# EAGLE design interface-2-cart (EAGLE 9.4.2)
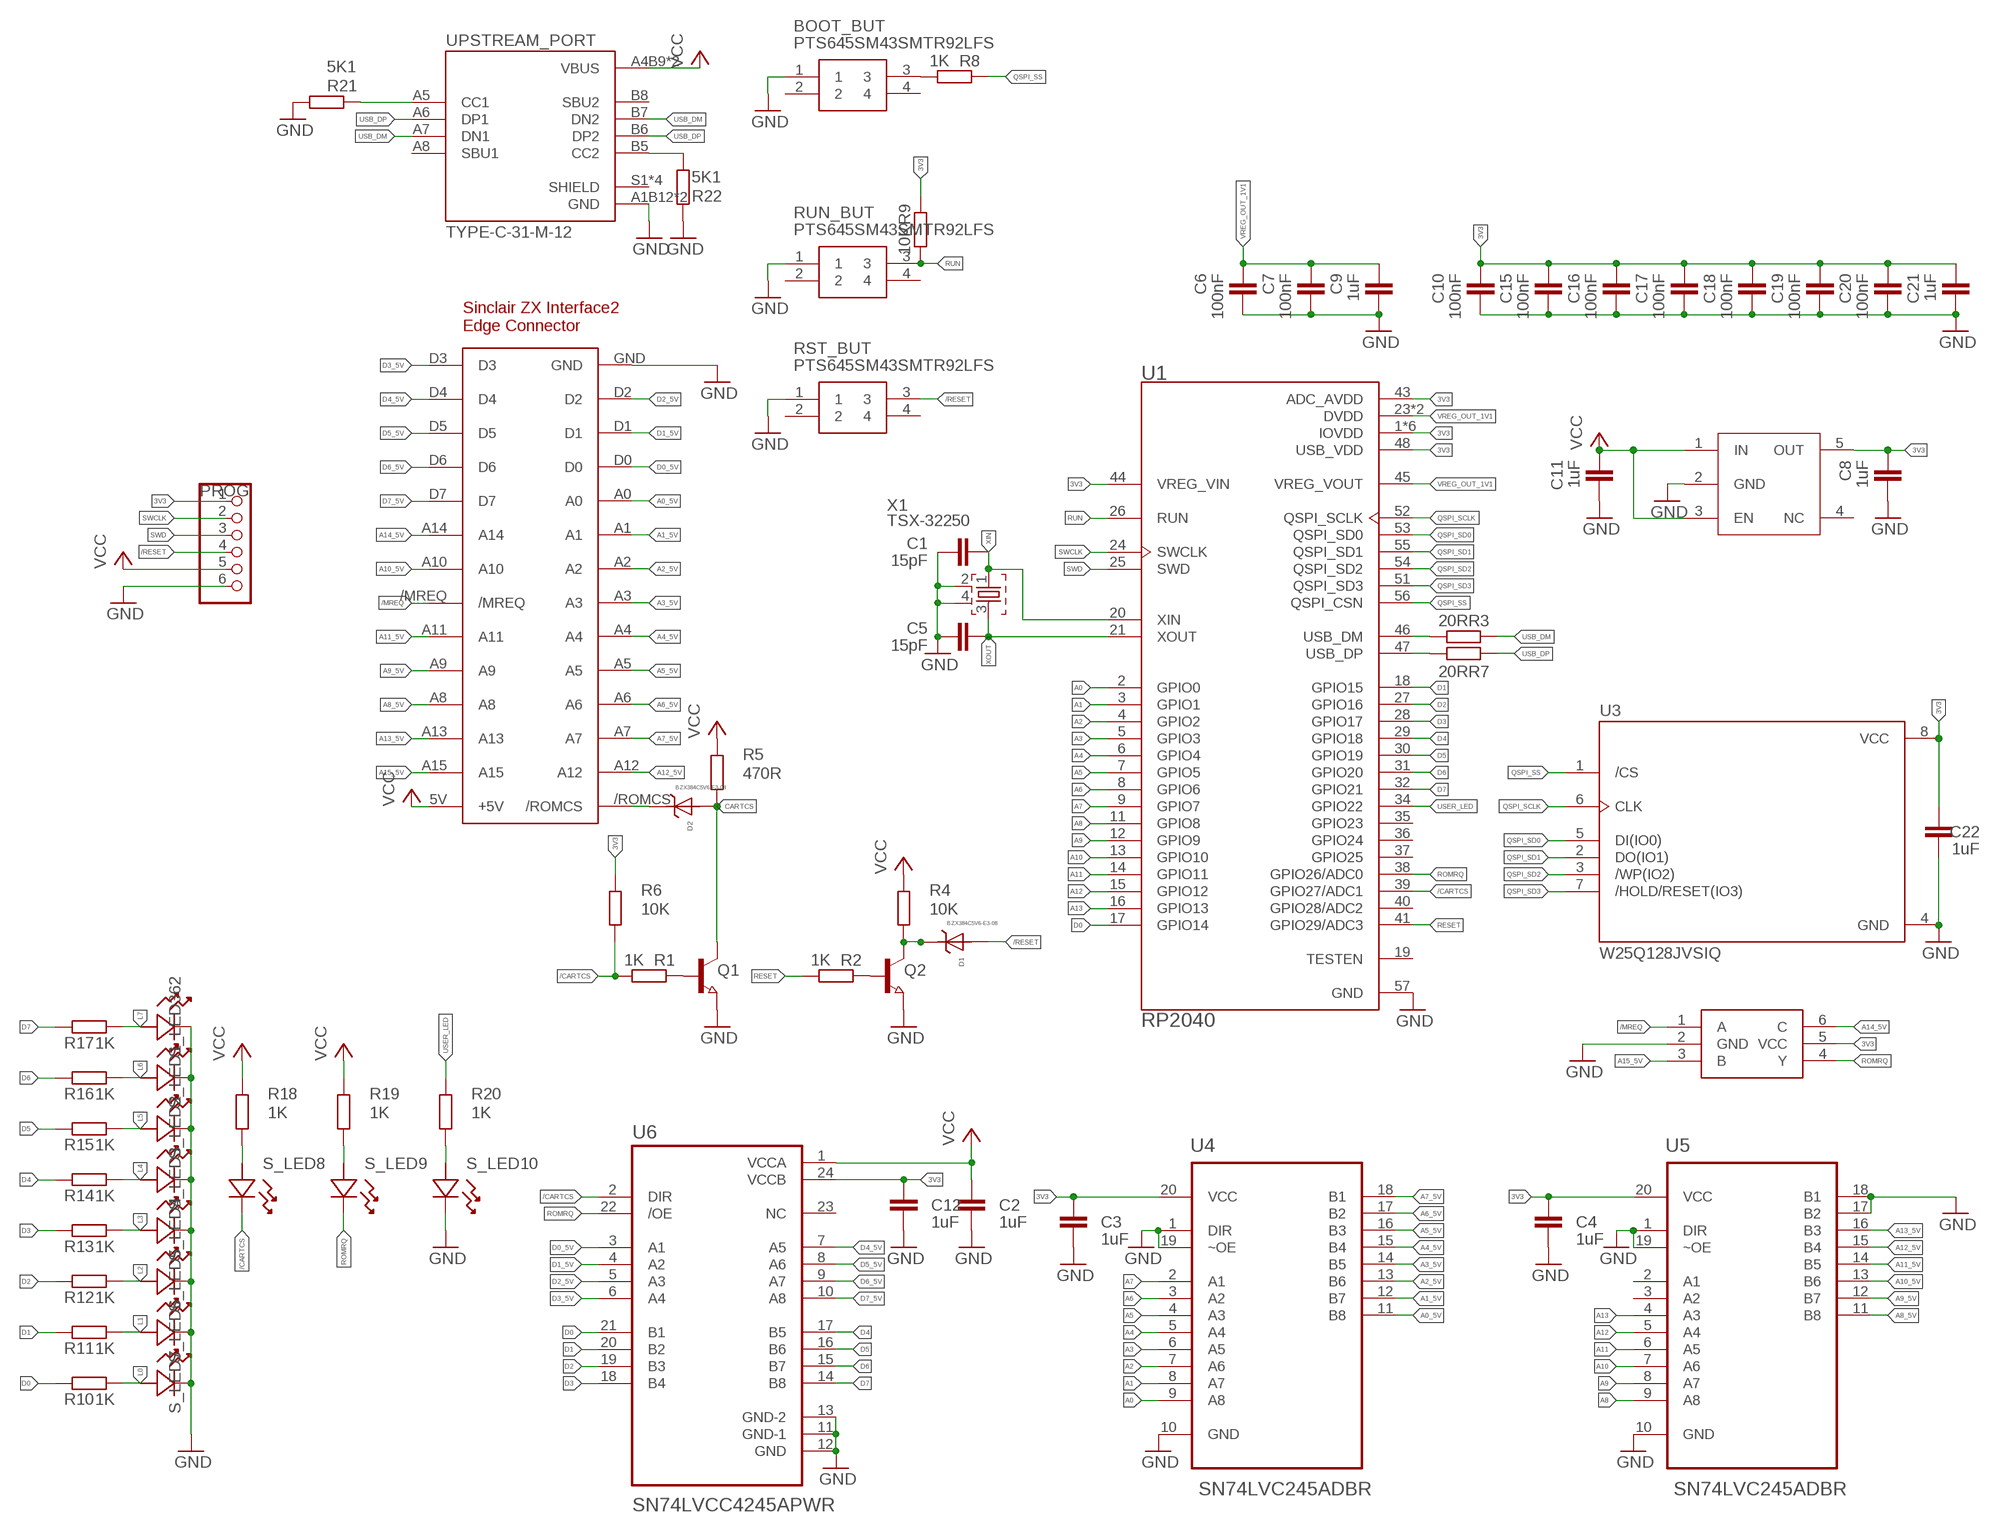
[diagram p0: schematic, sheet 1]

## Parts
3V3_REG2  3V3  NCP718BSN330T1G  [NCP718BSN330T1G]
BOOT_BUT  PTS645SM43SMTR92LFS  [PTS645(SMT)]
C1  15pF  C-EUC0402  [C0402]
C2  1uF  C-EUC0402  [C0402]
C3  1uF  C-EUC0402  [C0402]
C4  1uF  C-EUC0402  [C0402]
C5  15pF  C-EUC0402  [C0402]
C6  100nF  C-EUC0402  [C0402]
C7  100nF  C-EUC0402  [C0402]
C8  1uF  C-EUC0402  [C0402]
C9  1uF  C-EUC0402  [C0402]
C10  100nF  C-EUC0402  [C0402]
C11  1uF  C-EUC0402  [C0402]
C12  1uF  C-EUC0402  [C0402]
C15  100nF  C-EUC0402  [C0402]
C16  100nF  C-EUC0402  [C0402]
C17  100nF  C-EUC0402  [C0402]
C18  100nF  C-EUC0402  [C0402]
C19  100nF  C-EUC0402  [C0402]
C20  100nF  C-EUC0402  [C0402]
C21  1uF  C-EUC0402  [C0402]
C22  1uF  C-EUC0402  [C0402]
D1  BZX384C5V6-E3-08  [SOD-323]
D2  BZX384C5V6-E3-08  [SOD-323]
PROG  PINHD-1X6  [1X06]
Q1  NPN-TRANSISTOR_SOT23  [SOT23]
Q2  NPN-TRANSISTOR_SOT23  [SOT23]
R1  1K  R-EU_R0402  [R0402]
R2  1K  R-EU_R0402  [R0402]
R3  20R  R-EU_R0402  [R0402]
R4  10K  R-EU_R0402  [R0402]
R5  470R  R-EU_R0402  [R0402]
R6  10K  R-EU_R0402  [R0402]
R7  20R  R-EU_R0402  [R0402]
R8  1K  R-EU_R0402  [R0402]
R9  10K  R-EU_R0402  [R0402]
R10  1K  R-EU_R0402  [R0402]
R11  1K  R-EU_R0402  [R0402]
R12  1K  R-EU_R0402  [R0402]
R13  1K  R-EU_R0402  [R0402]
R14  1K  R-EU_R0402  [R0402]
R15  1K  R-EU_R0402  [R0402]
R16  1K  R-EU_R0402  [R0402]
R17  1K  R-EU_R0402  [R0402]
R18  1K  R-EU_R0402  [R0402]
R19  1K  R-EU_R0402  [R0402]
R20  1K  R-EU_R0402  [R0402]
R21  5K1  R-EU_R0402  [R0402]
R22  5K1  R-EU_R0402  [R0402]
RST_BUT  PTS645SM43SMTR92LFS  [PTS645(SMT)]
RUN_BUT  PTS645SM43SMTR92LFS  [PTS645(SMT)]
S_LED1  20mA  VLMW1500-GS08  [LED_VLMW15_VIS]
S_LED2  20mA  VLMW1500-GS08  [LED_VLMW15_VIS]
S_LED3  20mA  VLMW1500-GS08  [LED_VLMW15_VIS]
S_LED4  20mA  VLMW1500-GS08  [LED_VLMW15_VIS]
S_LED5  20mA  VLMW1500-GS08  [LED_VLMW15_VIS]
S_LED6  20mA  VLMW1500-GS08  [LED_VLMW15_VIS]
S_LED7  20mA  VLMW1500-GS08  [LED_VLMW15_VIS]
S_LED8  20mA  VLMW1500-GS08  [LED_VLMW15_VIS]
S_LED9  20mA  VLMW1500-GS08  [LED_VLMW15_VIS]
S_LED10  20mA  VLMW1500-GS08  [LED_VLMW15_VIS]
S_LED362  20mA  VLMW1500-GS08  [LED_VLMW15_VIS]
U1  RP2040  [QFN40P700X700X90-57N]
U3  W25Q128JVSIQ  [SOIC127P790X216-8N]
U4  SN74LVC245ADBR  [SOP65P780X200-20N]
U5  SN74LVC245ADBR  [SOP65P780X200-20N]
U6  SN74LVCC4245APWR  [SOP65P640X120-24N]
U$1  ZX_I2_ROM_EDGE_CONNECTOR  [ZX_I2_ROM_EDGE_CONNECTOR_V2]
U$2  74LVC1G332GW,125  [SOP65P210X110-6N]
UPSTREAM_PORT  TYPE-C-31-M-12  [HRO_TYPE-C-31-M-12]
X1  TSX-32250  [TSX-3225]

## Nets
3V3: 3V3_REG2.5(OUT) C3.2 C4.2 C8.1 C10.1 C12.2 C15.1 C16.1 C17.1 C18.1 C19.1 C20.1 C21.1 C22.1 PROG.1 R6.1 R9.2 U1.1(IOVDD) U1.10(IOVDD) U1.22(IOVDD) U1.33(IOVDD) U1.42(IOVDD) U1.43(ADC_AVDD) U1.44(VREG_VIN) U1.48(USB_VDD) U1.49(IOVDD) U3.8(VCC) U4.20(VCC) U5.20(VCC) U6.24(VCCB) U$2.5(VCC)
/CARTCS: R1.1 R6.2 S_LED8.C U1.39(GPIO27/ADC1) U6.2(DIR)
/MREQ: U$1./MREQ U$2.1(A)
/RESET: D1.A PROG.4 RST_BUT.3
/RESET_PROTECTED: D1.C Q2.3(C) R4.2
A0: U1.2(GPIO0) U4.9(A8)
A0_5V: U4.11(B8) U$1.A0
A1: U1.3(GPIO1) U4.8(A7)
A1_5V: U4.12(B7) U$1.A1
A2: U1.4(GPIO2) U4.7(A6)
A2_5V: U4.13(B6) U$1.A2
A3: U1.5(GPIO3) U4.6(A5)
A3_5V: U4.14(B5) U$1.A3
A4: U1.6(GPIO4) U4.5(A4)
A4_5V: U4.15(B4) U$1.A4
A5: U1.7(GPIO5) U4.4(A3)
A5_5V: U4.16(B3) U$1.A5
A6: U1.8(GPIO6) U4.3(A2)
A6_5V: U4.17(B2) U$1.A6
A7: U1.9(GPIO7) U4.2(A1)
A7_5V: U4.18(B1) U$1.A7
A8: U1.11(GPIO8) U5.9(A8)
A8_5V: U5.11(B8) U$1.A8
A9: U1.12(GPIO9) U5.8(A7)
A9_5V: U5.12(B7) U$1.A9
A10: U1.13(GPIO10) U5.7(A6)
A10_5V: U5.13(B6) U$1.A10
A11: U1.14(GPIO11) U5.6(A5)
A11_5V: U5.14(B5) U$1.A11
A12: U1.15(GPIO12) U5.5(A4)
A12_5V: U5.15(B4) U$1.A12
A13: U1.16(GPIO13) U5.4(A3)
A13_5V: U5.16(B3) U$1.A13
A14_5V: U$1.A14 U$2.6(C)
A15_5V: U$1.A15 U$2.3(B)
CARTCS: D2.A Q1.3(C) R5.2
D0: R10.2 U1.17(GPIO14) U6.21(B1)
D0_5V: U6.3(A1) U$1.D0
D1: R11.2 U1.18(GPIO15) U6.20(B2)
D1_5V: U6.4(A2) U$1.D1
D2: R12.2 U1.27(GPIO16) U6.19(B3)
D2_5V: U6.5(A3) U$1.D2
D3: R13.2 U1.28(GPIO17) U6.18(B4)
D3_5V: U6.6(A4) U$1.D3
D4: R14.2 U1.29(GPIO18) U6.17(B5)
D4_5V: U6.7(A5) U$1.D4
D5: R15.2 U1.30(GPIO19) U6.16(B6)
D5_5V: U6.8(A6) U$1.D5
D6: R16.2 U1.31(GPIO20) U6.15(B7)
D6_5V: U6.9(A7) U$1.D6
D7: R17.2 U1.32(GPIO21) U6.14(B8)
D7_5V: U6.10(A8) U$1.D7
GND: 3V3_REG2.2(GND) BOOT_BUT.1 C1.2 C2.1 C3.1 C4.1 C5.2 C6.2 C7.2 C8.2 C9.2 C10.2 C11.2 C12.1 C15.2 C16.2 C17.2 C18.2 C19.2 C20.2 C21.2 C22.2 PROG.6 Q1.2(E) Q2.2(E) R21.1 R22.1 RST_BUT.1 RUN_BUT.1 S_LED1.C S_LED2.C S_LED3.C S_LED4.C S_LED5.C S_LED6.C S_LED7.C S_LED10.C S_LED362.C U1.57(GND) U3.4(GND) U4.1(DIR) U4.10(GND) U4.19(~OE) U5.1(DIR) U5.10(GND) U5.17(B2) U5.18(B1) U5.19(~OE) U6.11(GND-1) U6.12(GND) U6.13(GND-2) U$1.GND U$2.2(GND) UPSTREAM_PORT.A1B12(GND) UPSTREAM_PORT.B1A12(GND) X1.2 X1.4
L0: R10.1 S_LED7.A
L1: R11.1 S_LED6.A
L2: R12.1 S_LED5.A
L3: R13.1 S_LED4.A
L4: R14.1 S_LED3.A
L5: R15.1 S_LED2.A
L6: R16.1 S_LED1.A
L7: R17.1 S_LED362.A
N$1: Q1.1(B) R1.2
N$2: Q2.1(B) R2.2
N$3: R3.1 U1.46(USB_DM)
N$4: R18.1 S_LED8.A
N$5: R19.1 S_LED9.A
N$6: R20.1 S_LED10.A
N$7: D2.C U$1./ROMCS
N$8: R7.1 U1.47(USB_DP)
N$9: BOOT_BUT.3 R8.1
N$18: R21.2 UPSTREAM_PORT.A5(CC1)
N$19: R22.2 UPSTREAM_PORT.B5(CC2)
QSPI_SCLK: U1.52(QSPI_SCLK) U3.6(CLK)
QSPI_SD0: U1.53(QSPI_SD0) U3.5(DI(IO0))
QSPI_SD1: U1.55(QSPI_SD1) U3.2(DO(IO1))
QSPI_SD2: U1.54(QSPI_SD2) U3.3(/WP(IO2))
QSPI_SD3: U1.51(QSPI_SD3) U3.7(/HOLD/RESET(IO3))
QSPI_SS: R8.2 U1.56(QSPI_CSN) U3.1(/CS)
RESET: R2.1 U1.41(GPIO29/ADC3)
ROMRQ: S_LED9.C U1.38(GPIO26/ADC0) U6.22(/OE) U$2.4(Y)
RUN: R9.1 RUN_BUT.3 U1.26(RUN)
SWCLK: PROG.2 U1.24(SWCLK)
SWD: PROG.3 U1.25(SWD)
USB_DM: R3.2 UPSTREAM_PORT.A7(DN1) UPSTREAM_PORT.B7(DN2)
USB_DP: R7.2 UPSTREAM_PORT.A6(DP1) UPSTREAM_PORT.B6(DP2)
USER_LED: R20.2 U1.34(GPIO22)
VCC: 3V3_REG2.1(IN) 3V3_REG2.3(EN) C2.2 C11.1 PROG.5 R4.1 R5.1 R18.2 R19.2 U6.1(VCCA) U$1.5V(+5V) UPSTREAM_PORT.A4B9(VBUS) UPSTREAM_PORT.B4A9(VBUS)
VREG_OUT_1V1: C6.1 C7.1 C9.1 U1.23(DVDD) U1.45(VREG_VOUT) U1.50(DVDD)
XIN: C1.1 U1.20(XIN) X1.1
XOUT: C5.1 U1.21(XOUT) X1.3
Unconnected: 3V3_REG2.4(NC) BOOT_BUT.2 BOOT_BUT.4 RST_BUT.2 RST_BUT.4 RUN_BUT.2 RUN_BUT.4 U1.19(TESTEN) U1.35(GPIO23) U1.36(GPIO24) U1.37(GPIO25) U1.40(GPIO28/ADC2) U5.2(A1) U5.3(A2) U6.23(NC) UPSTREAM_PORT.A8(SBU1) UPSTREAM_PORT.B8(SBU2) UPSTREAM_PORT.S1(SHIELD) UPSTREAM_PORT.S2(SHIELD) UPSTREAM_PORT.S3(SHIELD) UPSTREAM_PORT.S4(SHIELD)

## Library data of the parts
3V3_REG2 = IC-packages_BIG-pack V1.0:NCP718BSN330T1G
BOOT_BUT RST_BUT RUN_BUT = PTS645SM43SMTR92LFS:PTS645SM43SMTR92LFS: C & K COMPONENTS - PTS645SM43SMTR92LFS - SWITCH, SPST, 0.05A, 12VDC, SMD, 4.3MM Source: Datasheet <http://www.farnell.com/datasheets/1914518.pdf>; DESCRIPTION: C & K COMPONENTS - PTS645SM43SMTR92LFS - SWITCH, SPST, 0.05A, 12VDC, SMD, 4.3MM; HEIGHT: mm; MANUFACTURER_NAME: C & K COMPONENTS; MANUFACTURER_PART_NUMBER: PTS645SM43SMTR92LFS; MOUSER_PART_NUMBER: 611-PTS645SM43SMTR92; MOUSER_PRICE-STOCK: https://www.mouser.com/Search/Refine.aspx?Keyword=611-PTS645SM43SMTR92
C1-C12 C15-C22 = rcl:C-EU: CAPACITOR, European symbol; SPICEPREFIX: C
D1 D2 = BZX384C5V6-E3-08:BZX384C5V6-E3-08: VISHAY - Zener Single Diode, 5.6 V, 200 mW, SOD-323, 5 %, 2 Pins, 150 °C - SOD-323 Check availability <https://pricing.snapeda.com/parts/BZX384C5V6-E3-08/Vishay%20Semiconductors/view-part?ref=eda>; AVAILABILITY: In Stock; DESCRIPTION: Zener Diode Single 5.6V 5% 40Ohm 200mW 2-Pin SOD-323 T/R; MF: Vishay Semiconductors; MP: BZX384C5V6-E3-08; PACKAGE: None; PRICE: None; PURCHASE-URL: https://pricing.snapeda.com/search/part/BZX384C5V6-E3-08/?ref=eda
PROG = adafruit:PINHD-1X6: PIN HEADER
Q1 Q2 = semicon-smd-ipc:NPN-TRANSISTOR_: NPN TRANSISTOR
R1-R22 = rcl:R-EU_: RESISTOR, European symbol; SPICEPREFIX: R
S_LED1-S_LED10 S_LED362 = led-0402:VLMW1500-GS08; COPYRIGHT: Copyright (C) 2022 Ultra Librarian. All rights reserved.; MANUFACTURER_PART_NUMBER: VLMW1500-GS08; MFR_NAME: Vishay
U1 = RP2040:RP2040: Check availability <https://pricing.snapeda.com/parts/RP2040/Raspberry%20Pi/view-part?ref=eda>; AVAILABILITY: In Stock; CHECK_PRICES: https://www.snapeda.com/parts/RP2040/Raspberry+Pi/view-part/?ref=eda; DESCRIPTION: RP2040 chip for Raspberry Pi Pico - ARM® Cortex®-M0+ MCU 32-Bit; MF: Raspberry Pi; MP: RP2040; PACKAGE: None; PRICE: None; SNAPEDA_LINK: https://www.snapeda.com/parts/RP2040/Raspberry+Pi/view-part/?ref=snap
U3 = W25Q128JVSIQ:W25Q128JVSIQ: Check availability <https://pricing.snapeda.com/parts/W25Q128JVSIQ/Winbond%20Electronics/view-part?ref=eda>; AVAILABILITY: In Stock; CHECK_PRICES: https://www.snapeda.com/parts/W25Q128JVSIQ/Winbond+Electronics/view-part/?ref=eda; DESCRIPTION: FLASH - NOR Memory IC 128Mb (16M x 8) SPI - Quad I/O, QPI, DTR 133 MHz 8-SOIC; MF: Winbond Electronics; MP: W25Q128JVSIQ; PACKAGE: SOIC-8 Winbond Electronics; PRICE: None; PURCHASE-URL: https://www.snapeda.com/api/url_track_click_mouser/?unipart_id=1054022&manufacturer=Winbond Electronics&part_name=W25Q128JVSIQ&search_term=None; SNAPEDA_LINK: https://www.snapeda.com/parts/W25Q128JVSIQ/Winbond+Electronics/view-part/?ref=snap
U4 U5 = SN74LVC245ADBR:SN74LVC245ADBR: Check availability <https://pricing.snapeda.com/parts/SN74LVC245ADBR/Texas%20Instruments/view-part?ref=eda>; AVAILABILITY: In Stock; CHECK_PRICES: https://www.snapeda.com/parts/SN74LVC245ADBR/Texas+Instruments/view-part/?ref=eda; DESCRIPTION: Octal Bus Transceiver With 3-State Outputs; MF: Texas Instruments; MP: SN74LVC245ADBR; PACKAGE: SSOP-20 Texas Instruments; PRICE: None; SNAPEDA_LINK: https://www.snapeda.com/parts/SN74LVC245ADBR/Texas+Instruments/view-part/?ref=snap
U6 = SN74LVCC4245APWR:SN74LVCC4245APWR: Check availability <https://pricing.snapeda.com/parts/SN74LVCC4245APWR/Texas%20Instruments/view-part?ref=eda>; AVAILABILITY: In Stock; CHECK_PRICES: https://www.snapeda.com/parts/SN74LVCC4245APWR/Texas+Instruments/view-part/?ref=eda; DESCRIPTION: Octal Bus Transceiver With Adjustable Output Voltage and 3-State Outputs; MF: Texas Instruments; MP: SN74LVCC4245APWR; PACKAGE: TSSOP-24 Texas Instruments; PRICE: None; SNAPEDA_LINK: https://www.snapeda.com/parts/SN74LVCC4245APWR/Texas+Instruments/view-part/?ref=snap
U$1 = zxs_i2_rom_edge_connector:ZX_I2_ROM_EDGE_CONNECTOR: Edge connector pro ROM modul pro Interface 2 počítače ZX Spectrum
U$2 = 74LVC1G332GW_125:74LVC1G332GW,125
UPSTREAM_PORT = TYPE-C-31-M-12:TYPE-C-31-M-12: USB Connectors 24 Receptacle 1 8.94*7.3mm RoHS Check availability <https://pricing.snapeda.com/parts/TYPE-C-31-M-12/HRO%20Electronics%20Co.%2C%20Ltd./view-part?ref=eda>; AVAILABILITY: In Stock; DESCRIPTION: USB Connectors 24 Receptacle 1 8.94*7.3mm RoHS; MF: HRO Electronics Co., Ltd.; MP: TYPE-C-31-M-12; PACKAGE: Package; PRICE: None
X1 = TSX-3225:TSX-3225: MHz RANGE CRYSTAL UNIT Source: Epson Toyocom Check availability <https://pricing.snapeda.com/parts/TSX-3225/EPSON/view-part?ref=eda>; AVAILABILITY: Not in stock; DESCRIPTION: 38.4MHz ±10ppm Crystal 8.5pF 40 Ohms 4-SMD, No Lead; MF: EPSON; MP: TSX-3225; PACKAGE: SMD-4 EPSON; PRICE: None

## Board
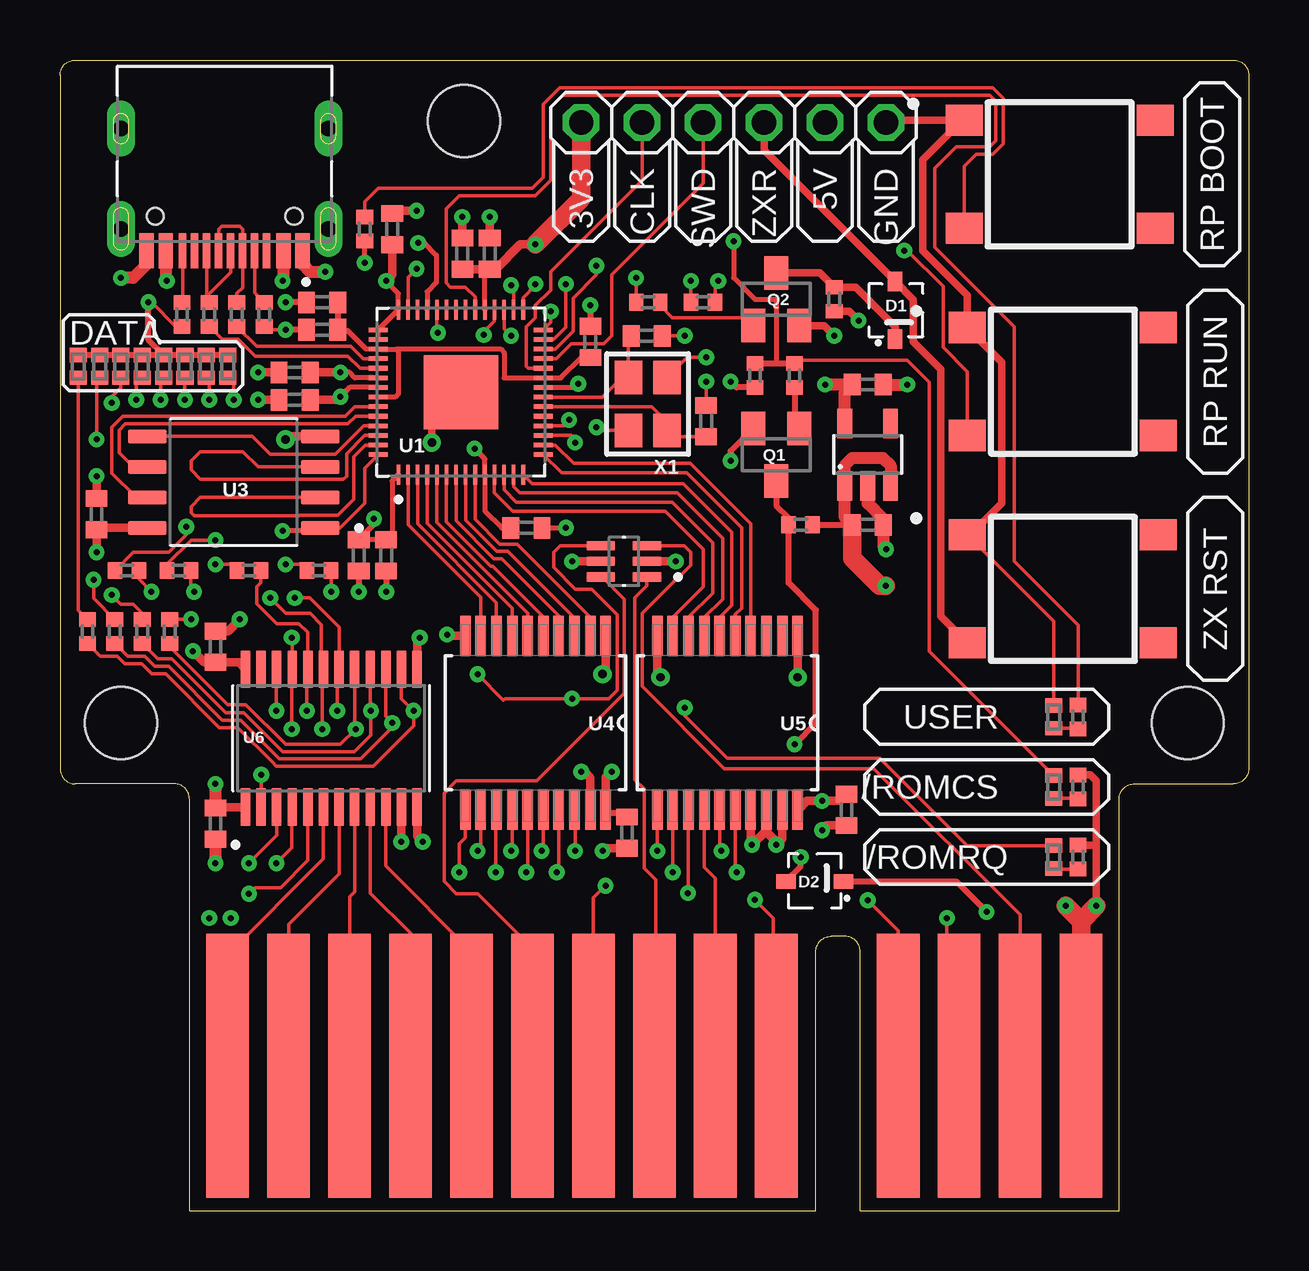
[diagram p1: board, top side]
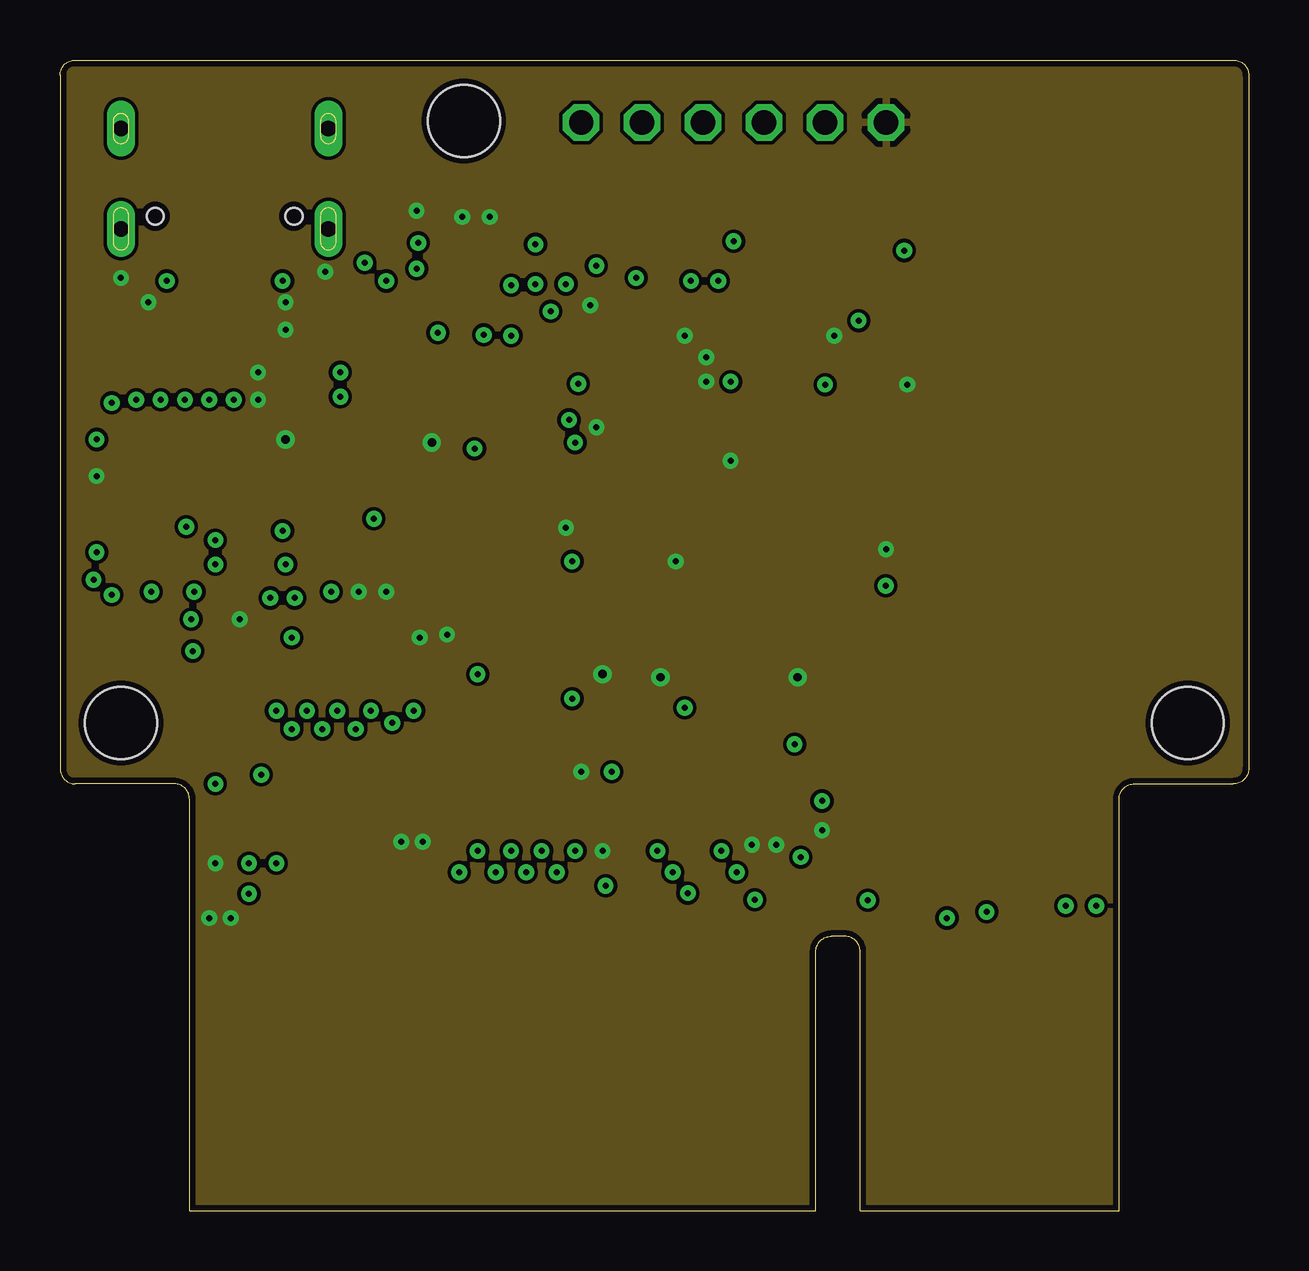
[diagram p2: board, inner layer Route2]
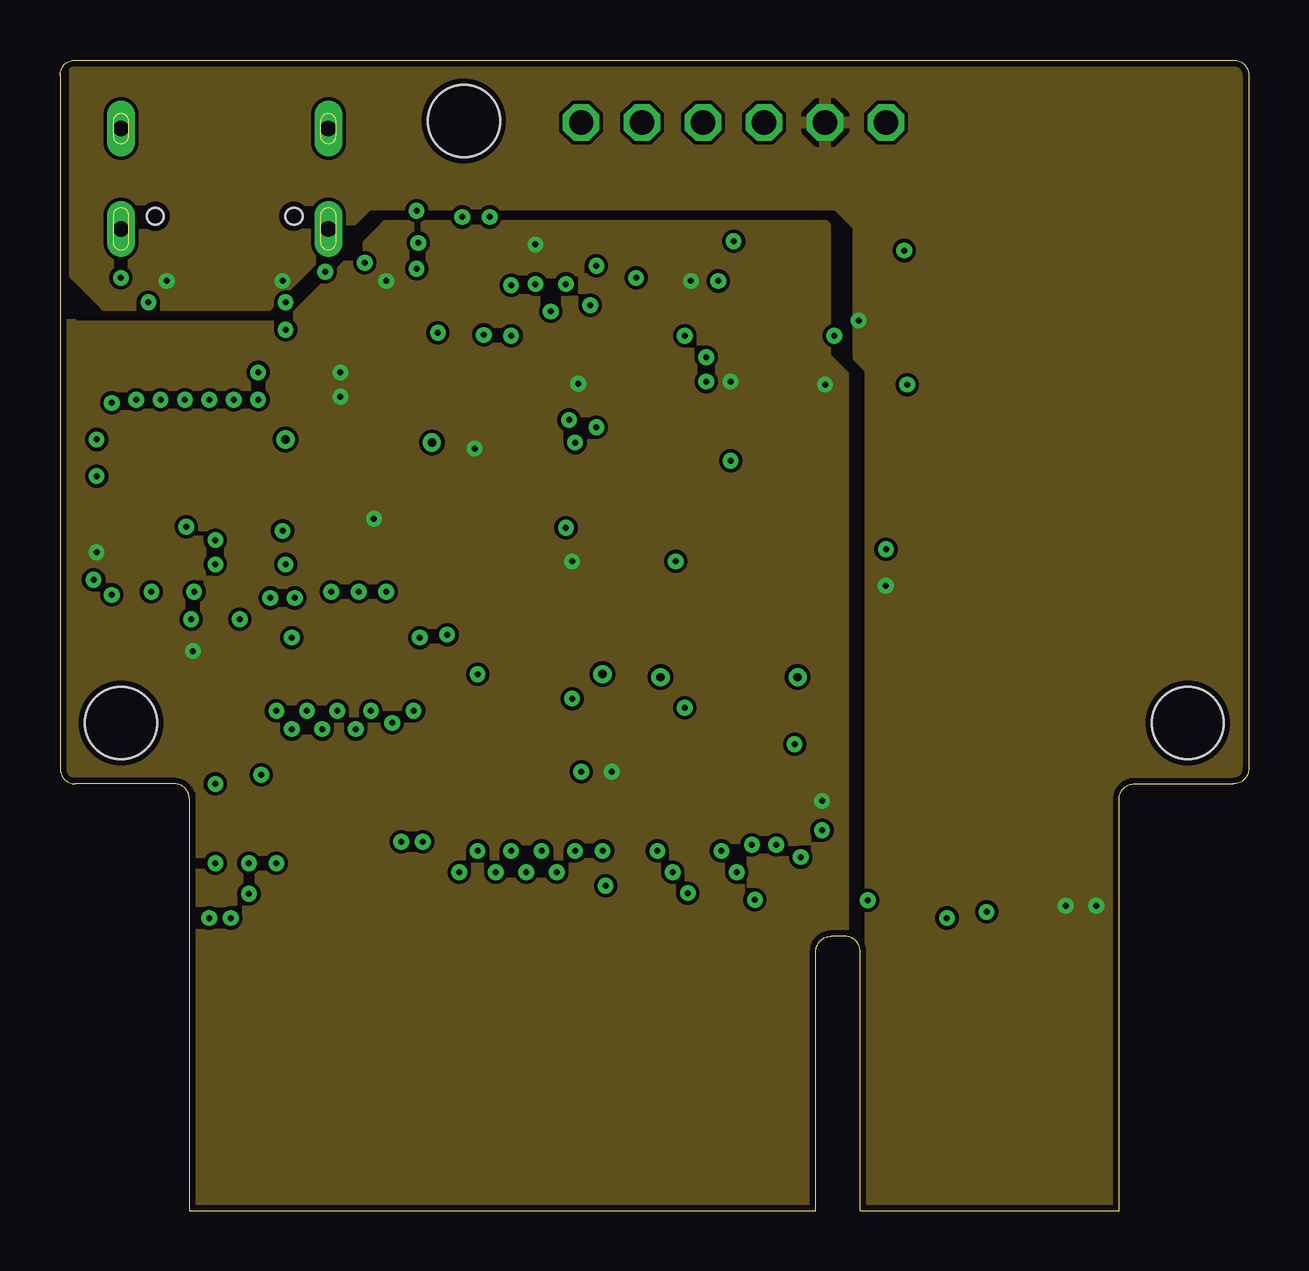
[diagram p3: board, inner layer Route15]
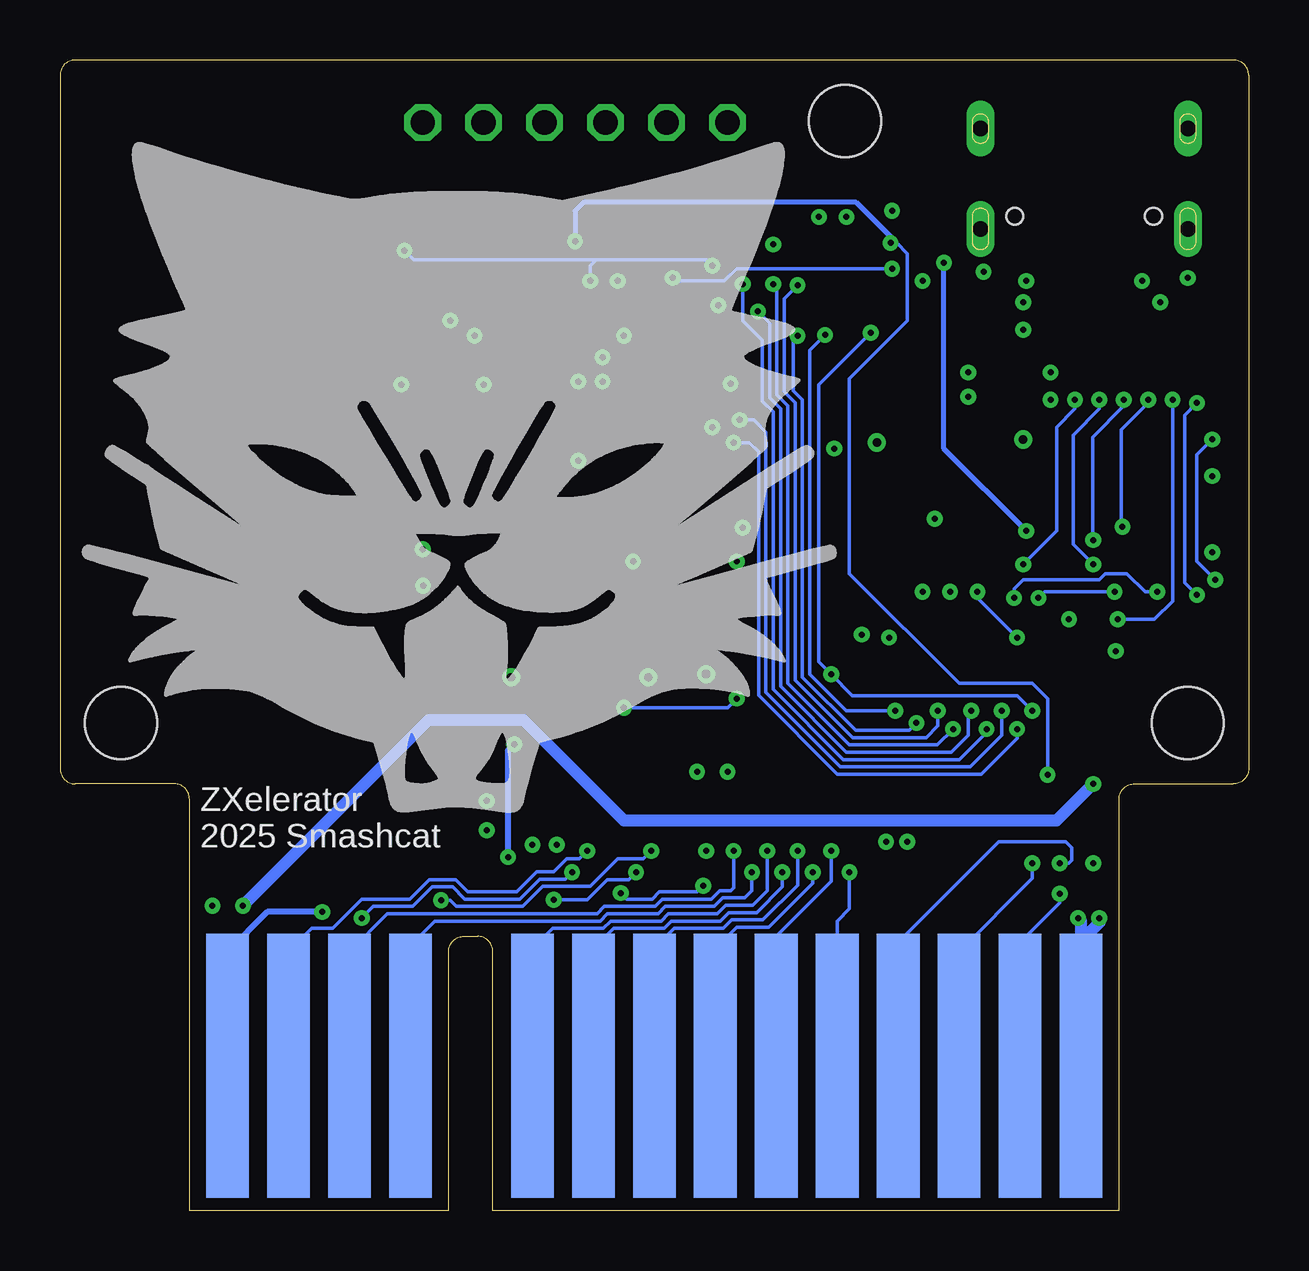
[diagram p4: board, bottom side, seen from below]

Size 49.53 x 47.94 mm. Coordinates in mm from the lower left corner, seen from the top.
Outline: 5.4,0 31.5,0 31.5,10.79 arc-90 32.13,11.43 32.7,11.43 arc-90 33.34,10.79 33.34,0 44.13,0 44.13,17.14 arc-90 44.77,17.78 48.9,17.78 arc90 49.53,18.41 49.53,47.31 arc90 48.9,47.94 0.64,47.94 arc90 0,47.31 0,18.41 arc90 0.64,17.78 4.76,17.78 arc-90 5.4,17.14 5.4,0
Copper layers (1+2*15+16): Top 0.035mm / dielectric 0.1mm / Route2 0.0175mm / dielectric 1.265mm / Route15 0.0175mm / dielectric 0.1mm / Bottom 0.035mm
Design rules "moje_1 *": minimum track width 6mil, minimum drill 0.2mm, track to track 6mil, track to pad 6mil, pad to pad 6mil, via to via 6mil, smd to smd 6mil, copper to edge 10mil, drill to drill 6mil, minimum pad ring 10mil, minimum via ring 8mil, stop-mask expansion 4mil, vias tented up to drill 0mil, thermal gap 10mil
Holes 3 mm at 2.54,20.32 46.99,20.32 16.83,45.4

### Footprints (pad centres in the part's own frame; a part is rotated, then mirrored left to right if it is on the bottom)
NCP718BSN330T1G = smd 0.62 x 1.22: 1 -0.95,-1.3; 2 0,-1.3; 3 0.95,-1.3; 4 0.95,1.3; 5 -0.95,1.3
PTS645(SMT) = smd 1.55 x 1.3: 1 -3.975,2.25; 2 3.975,2.25; 3 -3.975,-2.25; 4 3.975,-2.25
C0402 = smd 0.7 x 0.9: 1 -0.65,0; 2 0.65,0
SOD-323 = smd 0.8 x 0.6: A 1.25,0; C -1.15,0
1X06 = drill 1.016 octagon: 1 -6.35,0; 2 -3.81,0; 3 -1.27,0; 4 1.27,0; 5 3.81,0; 6 6.35,0
SOT23 = smd 1 x 1.4: 1 -0.95,-1.1; 2 0.95,-1.1; 3 0,1.1
R0402 = smd 0.6 x 0.7: 1 -0.5,0; 2 0.5,0
LED_VLMW15_VIS = smd 0.597 x 0.711: A 0.476,0; C -0.476,0
QFN40P700X700X90-57N = smd 0.84 x 0.2: 1 -3.435,2.6; 2 -3.435,2.2; 3 -3.435,1.8; 4 -3.435,1.4; 5 -3.435,1; 6 -3.435,0.6; 7 -3.435,0.2; 8 -3.435,-0.2; 9 -3.435,-0.6; 10 -3.435,-1; 11 -3.435,-1.4; 12 -3.435,-1.8; 13 -3.435,-2.2; 14 -3.435,-2.6; 29 3.435,-2.6; 30 3.435,-2.2; 31 3.435,-1.8; 32 3.435,-1.4; 33 3.435,-1; 34 3.435,-0.6; 35 3.435,-0.2; 36 3.435,0.2; 37 3.435,0.6; 38 3.435,1; 39 3.435,1.4; 40 3.435,1.8; 41 3.435,2.2; 42 3.435,2.6 | smd 0.2 x 0.84: 15 -2.6,-3.435; 16 -2.2,-3.435; 17 -1.8,-3.435; 18 -1.4,-3.435; 19 -1,-3.435; 20 -0.6,-3.435; 21 -0.2,-3.435; 22 0.2,-3.435; 23 0.6,-3.435; 24 1,-3.435; 25 1.4,-3.435; 26 1.8,-3.435; 27 2.2,-3.435; 28 2.6,-3.435; 43 2.6,3.435; 44 2.2,3.435; 45 1.8,3.435; 46 1.4,3.435; 47 1,3.435; 48 0.6,3.435; 49 0.2,3.435; 50 -0.2,3.435; 51 -0.6,3.435; 52 -1,3.435; 53 -1.4,3.435; 54 -1.8,3.435; 55 -2.2,3.435; 56 -2.6,3.435 | smd 3.1 x 3.1: 57 0,0
SOIC127P790X216-8N = smd 1.61 x 0.58: 1 -3.605,1.905; 2 -3.605,0.635; 3 -3.605,-0.635; 4 -3.605,-1.905; 5 3.605,-1.905; 6 3.605,-0.635; 7 3.605,0.635; 8 3.605,1.905
SOP65P780X200-20N = smd 1.651 x 0.432: 1 -3.632,2.921; 2 -3.632,2.286; 3 -3.632,1.626; 4 -3.632,0.965; 5 -3.632,0.33; 6 -3.632,-0.33; 7 -3.632,-0.965; 8 -3.632,-1.626; 9 -3.632,-2.286; 10 -3.632,-2.921; 11 3.632,-2.921; 12 3.632,-2.286; 13 3.632,-1.626; 14 3.632,-0.965; 15 3.632,-0.33; 16 3.632,0.33; 17 3.632,0.965; 18 3.632,1.626; 19 3.632,2.286; 20 3.632,2.921
SOP65P640X120-24N = smd 1.57 x 0.41: 1 -2.87,3.575; 2 -2.87,2.925; 3 -2.87,2.275; 4 -2.87,1.625; 5 -2.87,0.975; 6 -2.87,0.325; 7 -2.87,-0.325; 8 -2.87,-0.975; 9 -2.87,-1.625; 10 -2.87,-2.275; 11 -2.87,-2.925; 12 -2.87,-3.575; 13 2.87,-3.575; 14 2.87,-2.925; 15 2.87,-2.275; 16 2.87,-1.625; 17 2.87,-0.975; 18 2.87,-0.325; 19 2.87,0.325; 20 2.87,0.975; 21 2.87,1.625; 22 2.87,2.275; 23 2.87,2.925; 24 2.87,3.575
ZX_I2_ROM_EDGE_CONNECTOR_V2 = smd 1.778 x 11: 5V 10.16,5.08; /MREQ -7.62,5.08; A8 2.54,5.08; A9 -2.54,5.08; A10 -10.16,5.08; A11 -5.08,5.08; A13 5.08,5.08; A14 -12.7,5.08; A15 7.62,5.08; D3 -25.4,5.08; D4 -22.86,5.08; D5 -20.32,5.08; D6 -17.78,5.08; D7 -15.24,5.08 | smd 1.778 x 11 bottom: /ROMCS 10.16,5.08; A0 -15.24,5.08; A1 -12.7,5.08; A2 -10.16,5.08; A3 -7.62,5.08; A4 -5.08,5.08; A5 -2.54,5.08; A6 2.54,5.08; A7 5.08,5.08; A12 7.62,5.08; D0 -17.78,5.08; D1 -20.32,5.08; D2 -22.86,5.08; GND -25.4,5.08
SOP65P210X110-6N = smd 1.19 x 0.4: 1 -0.96,0.65; 2 -0.96,0; 3 -0.96,-0.65; 4 0.96,-0.65; 5 0.96,0; 6 0.96,0.65
HRO_TYPE-C-31-M-12 = smd 0.6 x 1.45: A1B12 -3.25,5.095; A4B9 -2.45,5.095; B1A12 3.25,5.095; B4A9 2.45,5.095 | smd 0.3 x 1.45: A5 -1.25,5.095; A6 -0.25,5.095; A7 0.25,5.095; A8 1.25,5.095; B5 1.75,5.095; B6 0.75,5.095; B7 -0.75,5.095; B8 -1.75,5.095 | drill 0.65 pad 1.05 long: S1 -4.32,4.18; S2 4.32,4.18; S3 -4.32,0; S4 4.32,0 | hole 0.7: -2.89,3.65; 2.89,3.65
TSX-3225 = smd 1.4 x 1.15: 1 0,-1.6; 2 2.2,-1.6; 3 2.2,0; 4 0,0

### Placement (x,y rotation side)
3V3_REG2  33.66,31.5 0 top
BOOT_BUT  41.66,43.18 0 top
C1  26.92,32.89 90 top
C2  6.48,16.13 90 top
C3  13.59,27.3 90 top
C4  23.62,15.75 90 top
C5  24.45,36.45 0 top
C6  10.92,36.7 180 top
C7  10.92,37.85 180 top
C8  33.66,34.42 0 top
C9  22.1,36.2 90 top
C10  12.45,27.3 270 top
C11  33.66,28.57 0 top
C12  6.48,23.5 270 top
C15  9.78,33.78 180 top
C16  9.78,34.92 180 top
C17  32.77,16.7 270 top
C18  1.52,29.02 90 top
C19  16.76,39.88 90 top
C20  17.91,39.88 90 top
C21  13.84,40.89 90 top
C22  19.43,28.45 0 top
D1  34.8,37.47 90 top
D2  31.5,13.72 180 top
PROG  28.07,45.34 0 top
Q1  29.84,31.5 180 top
Q2  29.84,37.97 0 top
R1  30.61,34.8 270 top
R2  24.51,37.85 0 top
R3  7.37,37.34 90 top
R4  32.26,37.97 90 top
R5  30.86,28.57 180 top
R6  28.96,34.8 90 top
R7  6.22,37.34 90 top
R8  12.7,40.89 270 top
R9  26.8,37.85 180 top
R10  10.79,26.67 0 top
R11  7.87,26.67 0 top
R12  4.95,26.67 0 top
R13  2.79,26.67 0 top
R14  4.57,24.13 270 top
R15  3.43,24.13 270 top
R16  2.29,24.13 270 top
R17  1.14,24.13 270 top
R18  42.42,17.65 90 top
R19  42.42,14.73 90 top
R20  42.42,20.57 90 top
R21  8.51,37.34 90 top
R22  5.08,37.34 90 top
RST_BUT  41.78,25.91 0 top
RUN_BUT  41.78,34.54 0 top
S_LED1  1.65,35.18 270 top
S_LED2  2.54,35.18 270 top
S_LED3  3.43,35.18 270 top
S_LED4  4.32,35.18 270 top
S_LED5  5.21,35.18 270 top
S_LED6  6.1,35.18 270 top
S_LED7  6.99,35.18 270 top
S_LED8  41.4,17.65 270 top
S_LED9  41.4,14.73 270 top
S_LED10  41.4,20.57 270 top
S_LED362  0.76,35.18 270 top
U1  16.7,34.1 90 top
U3  7.24,30.35 180 top
U4  19.81,20.32 270 top
U5  27.81,20.32 270 top
U6  11.3,19.68 90 top
U$1  32.38,0.95 0 top
U$2  23.5,27.05 180 top
UPSTREAM_PORT  6.86,45.09 180 top
X1  23.69,32.51 90 top

### Tracks (layer width: path | path; a pad name or v marks a point on that pad's centre or on a via)
3V3  (via drill 0.25)
  Top 0.152: R9.2 v26.29,38.73
  Top 0.203: C22.1 18.4,28.45 17.7,29.15 U1.10 17.7,31.32 v17.27,31.75 | U1.44 U1.43 U1.42 14.1,38.22 v13.59,38.73 | U1.1 13.84,30.41 13.84,28.21 C3.2 C10.1 | U1.48 12.29,34.7 12.06,34.92 v11.68,34.92 | U1.49 12.07,34.3 v11.68,33.91 11.56,33.78 | U1.22 21.43,34.3 v21.59,34.46 | C20.1 17.7,39.02 U1.33
  Top 0.254: C4.2 23.46,16.56 22.86,16.56 U4.20 | v13.08,28.83 13.08,28.59 C10.1 | R6.1 28.19,34.3 v27.95,34.54 v27.94,34.54 | C18.1 1.6,28.45
  Top 0.356: U$2.5 v21.34,27.05 | U4.20 22.73,18.09 22.94,18.29 v22.99,18.29 | U5.20 31.11,17.07 v31.75,17.07 32.48,17.07 C17.1 | v11.68,34.92 C16.1 | 11.56,33.78 C15.1 | C18.1 v1.52,27.43 | 1.6,28.45 U3.8 | v5.54,23.32 6.01,22.84 C12.2 7.44,22.84 U6.24 | C21.1 13.84,38.99 v13.59,38.73 | v19.81,40.26 19.18,40.26 18.15,39.23 C20.1 C19.1
  Top 0.508: 3V3_REG2.5 32.7,34.12 C8.1 v31.88,34.42
  Top 0.762: v19.81,40.26 21.72,42.16 PROG.1
  pour Route15: -3.17,50.8 -3.17,-2.54 32.64,-2.54 32.64,34.8 31.88,35.56 31.88,41.02 13.59,41.02 9.4,36.83 0.64,36.83 -0.64,38.1 -0.64,50.8
/CARTCS  (via drill 0.25)
  Top 0.152: R1.1 30.74,35.43 35.31,35.43 36.22,34.52 36.22,23.31 S_LED8.C | v8.38,18.16 U6.2
  Top 0.203: v28.07,40.39 28.07,38.86 28.96,37.97 29.84,37.97 29.84,35.3 | U1.39 15.3,38.3 15.68,38.68 15.68,39.82 15.18,40.32 v14.92,40.32
  Top 0.254: R6.2 29.84,35.3 R1.1
  Bottom 0.152: v14.92,40.32 14.67,40.32 14.22,39.88 14.22,37.08 16.64,34.67 16.64,26.54 12.06,21.97 9.02,21.97 8.38,21.34 v8.38,18.16
  Bottom 0.203: v28.07,40.39 28.07,41.66 27.71,42.01 16.36,42.01 14.92,40.58 v14.92,40.32
/MREQ
  Top 0.152: U$2.1 24.45,26.03 23.95,25.53 23.95,17.96 24.34,17.57 24.34,14.27 24.81,13.79 24.81,6.08 U$1./MREQ
/RESET
  Top 0.305: PROG.4 29.34,44.18 D1.A 35.56,37.95 35.56,36.2 36.7,35.05 36.7,24.76 RST_BUT.3
/RESET_PROTECTED
  Top 0.305: D1.C 34.8,36.83 33.16,38.47 R4.2 31.66,39.07 Q2.3
A0
  Top 0.152: U4.9 17.53,25.56 14.5,28.58 U1.2
A0_5V  (via drill 0.25)
  Top 0.152: v16.64,14.1 16.64,15.29 16.89,15.54 U4.11
  Bottom 0.152: v16.64,14.1 16.64,12.57 17.14,12.06 U$1.A0
A1
  Top 0.152: U4.8 18.19,25.33 14.9,28.61 U1.3
A1_5V  (via drill 0.25)
  Top 0.152: v17.4,14.99 17.53,15.11 U4.12
  Bottom 0.152: v17.4,14.99 17.4,13.72 19.68,11.43 U$1.A1
A2
  Top 0.152: U4.7 18.85,25.1 15.3,28.64 U1.4
A2_5V  (via drill 0.25)
  Top 0.152: v18.16,14.1 18.16,16.66 U4.13
  Bottom 0.152: U$1.A2 22.23,10.92 21.34,11.81 19.99,11.81 18.16,13.64 v18.16,14.1
A3
  Top 0.152: U4.6 19.48,24.89 15.7,28.68 U1.5
A3_5V  (via drill 0.25)
  Top 0.152: v18.8,14.99 18.85,15.04 U4.14
  Bottom 0.152: U$1.A3 24.77,10.92 23.93,11.76 21.89,11.76 21.54,12.12 20.24,12.12 18.8,13.56 v18.8,14.99
A4
  Top 0.152: U4.5 20.14,24.74 18.03,26.86 17.95,26.86 16.1,28.71 U1.6
A4_5V  (via drill 0.25)
  Top 0.152: v19.43,14.1 19.48,14.15 U4.15
  Bottom 0.152: U$1.A4 27.3,10.92 26.47,11.76 24.36,11.76 24.05,12.07 22.02,12.07 21.66,12.42 20.5,12.42 19.43,13.48 v19.43,14.1
A5
  Top 0.152: U4.4 20.78,24.79 18.41,27.16 18.08,27.16 16.5,28.74 U1.7
A5_5V  (via drill 0.25)
  Top 0.152: v20.07,14.99 20.14,15.06 U4.16
  Bottom 0.152: U$1.A5 29.84,10.92 29.01,11.76 26.9,11.76 26.59,12.07 24.48,12.07 24.18,12.37 22.15,12.37 21.79,12.72 20.68,12.72 20.07,13.34 v20.07,14.99
A6
  Top 0.152: U1.8 16.9,28.77 18.2,27.46 18.66,27.46 21.44,24.69 U4.3
A6_5V  (via drill 0.25)
  Top 0.152: v20.7,14.1 20.78,14.17 U4.17
  Bottom 0.152: U$1.A6 34.92,11.05 33.91,12.07 27.02,12.07 26.72,12.37 24.61,12.37 24.3,12.68 22.27,12.68 21.92,13.03 21.01,13.03 20.7,13.34 v20.7,14.1
A7
  Top 0.152: U1.9 17.3,28.8 18.33,27.77 19.04,27.77 22.1,24.71 U4.2
A7_5V  (via drill 0.25)
  Top 0.152: v21.46,14.99 21.46,16.66 U4.18
  Bottom 0.152: U$1.A7 37.47,10.79 35.89,12.37 27.15,12.37 26.84,12.68 24.74,12.68 24.43,12.98 22.4,12.98 22.04,13.34 21.59,13.34 21.46,13.46 v21.46,14.99
A8
  Top 0.152: U5.9 25.53,24.71 26.8,25.98 26.8,27.56 25.21,29.14 18.86,29.14 18.1,29.9 U1.11
A8_5V  (via drill 0.25)
  Top 0.152: U$1.A8 34.92,11.66 v33.66,12.93 | v24.89,14.99 U5.11
  Bottom 0.152: v33.66,12.93 33.27,12.93 33.02,12.68 30.25,12.68 29.41,13.51 27.43,13.51 26.29,14.65 25.22,14.65 v24.89,14.99
A9
  Top 0.152: U1.12 18.5,30.03 19.01,29.52 25.52,29.52 27.2,27.84 27.2,25.73 26.19,24.71 U5.8
A9_5V  (via drill 0.25)
  Top 0.152: U$1.A9 29.72,6.16 29.72,12.19 v28.96,12.95 | v25.53,14.1 U5.12
  Bottom 0.152: v25.53,14.1 25.84,13.79 26.72,13.79 27.56,12.95 v28.96,12.95
A10
  Top 0.152: U5.7 26.85,24.71 27.61,25.48 27.61,28.02 25.72,29.9 19.15,29.9 18.9,30.16 U1.13
A10_5V  (via drill 0.25)
  Top 0.152: U$1.A10 22.23,13.03 v22.73,13.54 | v26.16,13.23 26.19,13.26 U5.13
  Bottom 0.152: v22.73,13.54 22.98,13.29 24.56,13.29 24.86,12.98 25.91,12.98 v26.16,13.23
A11
  Top 0.152: U5.6 27.48,24.71 27.99,25.22 27.99,28.27 25.98,30.28 19.68,30.28 U1.14
A11_5V
  Top 0.152: U5.14 26.85,14.3 27.3,13.84 U$1.A11
A12
  Top 0.152: U1.15 20.9,30.74 26.11,30.74 28.4,28.45 28.4,25.09 28.14,24.84 U5.5
A12_5V  (via drill 0.25)
  Top 0.152: v27.56,14.99 27.48,15.06 U5.15
  Bottom 0.152: U$1.A12 40.01,10.79 39.04,11.76 38.17,11.76 36.96,12.98 34.95,12.98 34.14,13.79 33.04,13.79 32.54,13.29 30.5,13.29 29.67,14.12 28.96,14.12 28.43,14.65 27.89,14.65 v27.56,14.99
A13
  Top 0.152: U1.16 20.64,31.9 21.41,31.14 26.27,31.14 28.78,28.63 U5.4
A13_5V  (via drill 0.25)
  Top 0.152: U$1.A13 36.96,6.54 v36.96,12.19 | v28.19,14.1 28.14,14.15 U5.16
  Bottom 0.152: v36.96,12.19 36.47,12.68 34.82,12.68 34.01,13.48 33.17,13.48 32.66,12.98 30.38,12.98 29.54,13.82 28.48,13.82 v28.19,14.1
A14_5V
  Top 0.152: U$2.6 22.59,26.4 23.52,25.47 23.52,21.56 19.86,17.91 16.51,17.91 16,17.4 16,13.72 16.51,13.21 17.4,13.21 19.68,10.92 U$1.A14
A15_5V
  Top 0.152: U$2.3 26.02,27.7 26.29,27.43 26.29,26.9 25.89,26.49 25.86,26.49 24.26,24.89 24.26,21.84 27.69,18.41 33.91,18.41 40.01,12.32 U$1.A15
CARTCS  (via drill 0.25)
  Top 0.254: Q1.3 29.84,29.38 30.36,28.86 R5.2 30.36,26.15 31.5,25.02 31.5,20.32 v30.61,19.43 | D2.A 30.86,14.33 v30.86,14.73
  Bottom 0.254: v30.86,14.73 30.86,19.18 v30.61,19.43
D0  (via drill 0.25)
  Top 0.152: v21.46,32 21.46,32.13 21.29,32.3 U1.17 | v11.3,25.78 11.3,26.66 R10.2 | v9.65,20.07 9.65,22.53 U6.21 9.68,23.85 v9.65,23.88
  Bottom 0.152: v9.65,20.07 9.65,19.68 11.15,18.19 17.14,18.19 20.42,21.47 20.42,31.62 20.8,32 v21.46,32 | v9.65,23.88 11.3,25.53 v11.3,25.78
D0_5V  (via drill 0.25)
  Top 0.152: v7.87,14.48 9.03,15.63 U6.3
  Bottom 0.152: U$1.D0 14.61,11.18 10.41,15.37 7.62,15.37 7.37,15.11 7.37,14.61 7.49,14.48 v7.87,14.48
D1  (via drill 0.25)
  Top 0.152: v21.21,32.94 21.21,32.89 21.02,32.7 U1.18 | R11.2 8.37,26.15 8.21,25.99 8.21,25.3 9.04,24.46 9.96,24.46 10.33,24.09 U6.20 10.29,22.51 v10.29,20.83
  Bottom 0.152: v10.29,20.83 10.29,19.81 11.61,18.49 17.01,18.49 20.12,21.59 20.12,32.44 20.62,32.94 v21.21,32.94
D1_5V  (via drill 0.25)
  Top 0.152: U6.4 9.65,16.79 9.65,15.11 v9.02,14.48
  Bottom 0.152: U$1.D1 12.06,10.79 9.02,13.84 v9.02,14.48
D2  (via drill 0.25)
  Top 0.152: U1.27 20.56,36.3 21.08,36.82 v21.08,38.61 | v5.59,25.78 5.45,25.92 R12.2 | v10.92,20.07 10.92,22.5 U6.19 10.89,22.64 10.89,24.42 10.42,24.89 9.4,24.89 v8.76,25.53
  Bottom 0.152: v10.92,20.07 10.92,19.94 12.06,18.8 16.89,18.8 19.81,21.72 19.81,33.28 20.27,33.73 20.27,36.27 21.08,37.08 v21.08,38.61 | v8.76,25.53 8.51,25.78 v5.59,25.78
D2_5V  (via drill 0.25)
  Top 0.152: U6.5 10.33,14.59 9.2,13.46 8.13,13.46 v7.87,13.21
  Bottom 0.152: U$1.D2 9.53,11.18 7.87,12.83 v7.87,13.21
D3  (via drill 0.25)
  Top 0.152: v20.45,37.47 20.45,37.01 U1.28 | v3.81,25.78 3.29,26.3 R13.2 | v11.56,20.83 11.56,22.48 U6.18 11.63,24.31 10.41,25.53 v9.78,25.53
  Bottom 0.152: v11.56,20.83 11.68,20.7 11.68,19.81 12.39,19.1 16.76,19.1 19.51,21.85 19.51,33.4 19.96,33.86 19.96,36.98 v20.45,37.47 | v9.78,25.53 9.78,25.91 9.4,26.29 6.22,26.29 5.97,26.54 5.08,26.54 4.32,25.78 v3.81,25.78
D3_5V
  Top 0.152: U$1.D3 6.99,10.67 10.98,14.66 U6.6
D4  (via drill 0.25)
  Top 0.152: v19.81,38.61 19.81,38.55 19.3,38.04 U1.29 | R14.2 4.57,23.5 6.99,21.08 7.75,21.08 9.4,19.43 11.68,19.43 v12.32,20.07 12.28,20.11 U6.17
  Bottom 0.152: v12.32,20.07 12.98,19.41 16.64,19.41 19.2,21.97 19.2,33.53 19.66,33.98 19.66,38.45 v19.81,38.61
D4_5V
  Top 0.152: U$1.D4 9.53,11.94 11.63,14.04 U6.7
D5  (via drill 0.25)
  Top 0.152: v18.8,38.56 18.9,38.46 U1.30 | R15.2 4.07,22.99 4.65,22.99 6.9,20.74 7.66,20.74 9.27,19.13 12.27,19.13 12.95,19.81 v12.95,20.83 12.93,20.85 U6.16
  Bottom 0.152: v12.95,20.83 12.95,20.19 13.44,19.71 16.51,19.71 18.9,22.1 18.9,33.66 19.35,34.11 19.35,38 v18.8,38.56
D5_5V
  Top 0.152: U$1.D5 12.06,13.08 12.28,13.29 U6.8
D6  (via drill 0.25)
  Top 0.152: v18.8,36.45 18.5,36.74 U1.31 | R16.2 2.81,23.1 3.53,23.1 3.95,22.68 4.52,22.68 6.77,20.43 7.53,20.43 9.14,18.82 12.52,18.82 13.84,20.14 v13.84,20.32 13.56,20.6 13.56,22.54 U6.15
  Bottom 0.152: v13.84,20.32 14.15,20.02 16.38,20.02 18.59,22.23 18.59,33.78 18.97,34.16 18.97,36.27 v18.8,36.45
D6_5V
  Top 0.152: U6.9 12.93,13.23 14.61,11.56 U$1.D6
D7  (via drill 0.25)
  Top 0.152: v17.65,36.49 17.65,36.61 18.1,37.06 U1.32 | R17.2 1.67,23.1 2.38,23.1 2.69,22.8 3.4,22.8 3.82,22.38 4.4,22.38 6.64,20.13 7.41,20.13 8.84,18.7 9.02,18.52 | 9.02,18.52 13.06,18.52 14.73,20.19 v14.73,20.83 14.22,21.34 U6.14 | 9.02,18.52
  Bottom 0.152: v14.73,20.83 16.76,20.83 18.29,22.35 18.29,35.85 v17.65,36.49
D7_5V
  Top 0.152: U6.10 13.58,14.36 17.14,10.79 U$1.D7
GND  (via drill 0.25, 0.35)
  Top 0.152: C5.2 v26.04,36.45 | C1.2 v26.92,34.54 | X1.2 26.13,35.56 v26.92,35.56 | X1.4 22.48,32.51 v22.35,32.64 | R22.1 4.83,36.84 3.82,37.85 v3.68,37.85 | R21.1 8.64,36.7 v9.4,36.7 | U5.18 29.44,15.85 | RST_BUT.1 41.4,24.56 S_LED10.C
  Top 0.203: C22.2 v21.08,28.45
  Top 0.254: C3.1 v13.59,25.78 | v22.1,37.72 C9.2 | C7.2 v9.4,37.85 | C6.2 v9.4,36.7 | C10.2 v12.45,25.78 | Q1.2 27.94,31.64 v27.94,31.24 | S_LED362.C S_LED1.C S_LED2.C S_LED3.C S_LED4.C | S_LED4.C S_LED5.C S_LED6.C S_LED7.C | S_LED4.C 3.68,36.29 v3.68,37.85 | v14.23,15.37 v14.22,15.37
  Top 0.305: U1.57 15.49,32.89 v15.49,32 | Q2.2 31.83,36.87 v32.26,36.45 | RST_BUT.1 37.94,28.16 39.24,29.46 39.24,35.36 RUN_BUT.1 37.81,38.14 35.94,40.01 35.94,43.78 37.59,45.43 | BOOT_BUT.1 37.59,45.43 | 37.59,45.43 34.51,45.43 PROG.6
  Top 0.356: U3.4 9.57,32.26 9.45,32.13 v9.4,32.13 | U5.10 24.89,22.43 25.02,22.3 v25.02,22.23 | U4.1 22.73,22.48 v22.61,22.35 | U5.1 v30.73,22.23 | v14.86,41.66 13.96,41.66 C21.2 | U$2.2 v25.65,27.05 | U4.19 22.1,18.03 21.84,18.29 v21.72,18.29 | v17.91,41.4 C20.2 | C16.2 v8.26,34.92 | C15.2 v8.26,33.78 | C18.2 v1.52,30.61 | C19.2 v16.76,41.4 | C17.2 31.95,16.05 v31.75,15.85 | U4.10 16.18,23.95 v16.13,24 | U6.11 v14.23,15.37 | U6.12 14.88,15.6 v15.11,15.37 | C12.1 7,24.14 v7.49,24.64 | U5.17 28.78,15.29 v28.83,15.24 29.44,15.85 | U5.19 30.1,15.49 v29.84,15.24 29.84,15.37 29.44,15.77 U5.18 | U6.13 14.88,23.77 v14.99,23.88 | C4.1 22.72,15.1 v22.61,14.99
  Top 0.508: C2.1 v6.48,14.48 | UPSTREAM_PORT.B1A12 3.61,39.42 3.05,38.86 v2.54,38.86 | UPSTREAM_PORT.A1B12 10.11,39.42 10.41,39.12 v11.05,39.12 | C8.2 v35.31,34.42 | v34.42,27.56 34.3,27.67 C11.2 34.3,28.81 33.66,29.46 3V3_REG2.2
  Bottom 0.508: v7.11,12.19 6.99,12.06 U$1.GND 6.99,11.24 6.22,12 v6.22,12.19
  pour Route2: -1.27,49.53 50.8,49.53 50.8,-1.27 -1.27,-1.27
L0  (via drill 0.25)
  Top 0.152: R10.1 10.04,26.92 v9.4,26.92 | v7.24,33.78 7.24,34.45 S_LED7.A
  Bottom 0.152: v9.4,26.92 8,28.32 8,32.64 7.24,33.4 v7.24,33.78
L1  (via drill 0.25)
  Top 0.152: R11.1 7.12,26.92 v6.48,26.92 | S_LED6.A 6.22,34.58 v6.22,33.78
  Bottom 0.152: v6.48,26.92 7.32,27.76 7.32,32.31 6.22,33.4 v6.22,33.78
L2  (via drill 0.25)
  Top 0.152: R12.1 4.45,26.93 5.46,27.94 v6.48,27.94 | v5.21,33.78 S_LED5.A
  Bottom 0.152: v6.48,27.94 6.5,27.96 6.5,32.23 5.21,33.53 v5.21,33.78
L3  (via drill 0.25)
  Top 0.152: R13.1 3.06,27.43 4.52,27.43 5.26,28.17 v5.26,28.5 | S_LED4.A 4.19,34.58 v4.19,33.78
  Bottom 0.152: v4.19,33.78 4.19,33.66 5.31,32.54 5.31,28.55 v5.26,28.5
L4  (via drill 0.25)
  Top 0.152: R14.1 v5.46,24.64 | v3.17,33.78 3.17,34.45 S_LED3.A
  Bottom 0.152: v5.46,24.64 3.94,24.64 3.17,25.4 v3.17,33.78
L5  (via drill 0.25)
  Top 0.152: R15.1 3.43,24.89 3.05,25.27 2.54,25.27 v2.16,25.65 | v2.16,33.66 2.16,33.91 2.54,34.29 S_LED2.A
  Bottom 0.152: v2.16,25.65 2.67,26.16 2.67,33.15 v2.16,33.66
L6  (via drill 0.25)
  Top 0.152: R16.1 1.4,25.52 v1.4,26.29 | S_LED1.A 1.52,34.58 v1.52,32.13
  Bottom 0.152: v1.4,26.29 2.16,27.05 2.16,31.5 v1.52,32.13
L7
  Top 0.152: R17.1 0.76,25.01 S_LED362.A
N$1
  Top 0.203: 30.61,32.78 Q1.1
  Top 0.254: R1.2 30.61,32.78
N$2
  Top 0.152: Q2.1 28.56,37.21 25.52,37.21 25.01,37.72 R2.2
N$3
  Top 0.152: U1.46 12.63,35.5 12.12,36.01 8.2,36.01 R3.1
N$4
  Top 0.152: S_LED8.A 42.39,17.18 R18.1
N$5
  Top 0.152: R19.1 41.43,14.23 S_LED9.A
N$6
  Top 0.152: S_LED10.A 42.39,20.1 R20.1
N$7  (via drill 0.25)
  Top 0.254: D2.C 37.34,13.72 v38.61,12.45
  Bottom 0.254: v38.61,12.45 40.89,12.45 42.55,10.79 U$1./ROMCS
N$8
  Top 0.152: U1.47 12.5,35.1 11.99,35.61 8.13,35.61 7.43,36.31 6.75,36.31 R7.1
N$9
  Top 0.152: R8.1 12.7,42.04 13.26,42.59 19.68,42.59 20.14,43.05 20.14,46.1 20.83,46.79 38.86,46.79 39.29,46.35 39.29,44.45 38.86,44.02 38.18,44.02 37.68,43.52 BOOT_BUT.3
N$18
  Top 0.152: UPSTREAM_PORT.A5 8.11,38.24 R21.2
N$19
  Top 0.152: UPSTREAM_PORT.B5 5.11,37.87 R22.2
QSPI_SCLK
  Top 0.152: U3.6 3.05,30.99 2.46,31.57 2.46,32.51 2.73,32.78 12,32.78 12.32,33.1 U1.52
QSPI_SD0
  Top 0.152: U1.53 12.66,32.7 11.47,31.51 8.75,31.51 8,32.26 U3.5
QSPI_SD1
  Top 0.152: U1.55 12.72,31.9 12.24,31.42 12.24,29.64 11.57,28.97 9.99,28.97 9.98,28.96 5.59,28.96 5.46,29.08 5.46,29.34 5.84,29.72 U3.2
QSPI_SD2
  Top 0.152: U3.3 8.26,30.99 7.62,31.62 5.84,31.62 5.46,31.24 5.46,30.86 5.84,30.48 11.81,30.48 11.94,30.61 11.94,31.55 12.69,32.3 U1.54
QSPI_SD3
  Top 0.152: U1.51 12.29,33.5 11.89,33.1 2.62,33.1 2.16,32.64 2.16,30.73 3.17,29.72 U3.7
QSPI_SS  (via drill 0.25)
  Top 0.152: U3.1 11.68,28.45 12.7,29.46 12.7,30.93 U1.56
  Top 0.203: U3.1 10.72,28.32 v9.27,28.32 | v12.7,39.5 R8.2
  Bottom 0.203: v9.27,28.32 12.7,31.75 v12.7,39.5
RESET  (via drill 0.25)
  Top 0.152: v24,38.86 R2.1 | U1.41 14.5,38.88 v14.86,39.24
  Bottom 0.152: v24,38.86 23.88,38.73 21.84,38.73 21.34,39.24 v14.86,39.24
ROMRQ  (via drill 0.25)
  Top 0.152: U$2.4 20.84,27.7 20.57,27.43 20.57,26.8 21.48,25.89 22.16,25.89 23.21,24.84 23.21,21.69 22.86,21.34 v21.34,21.34 18.54,21.34 18.48,21.27 v17.4,22.35 | v9.02,20.83 9.02,22.54 U6.22 | S_LED9.C 37.8,15.21 34.16,18.85 27.81,18.85 26.04,20.62 v26.04,20.95 | U1.38 15.7,36.62 v15.75,36.58
  Bottom 0.152: v9.02,20.83 9.65,21.46 16.51,21.46 v17.4,22.35 17.91,22.86 17.91,34.42 v15.75,36.58 | v26.04,20.95 21.72,20.95 v21.34,21.34
RUN  (via drill 0.25)
  Top 0.152: v22.35,39.37 22.35,38.99 21.39,38.02 21.39,36.64 20.64,35.9 U1.26 | RUN_BUT.3 37.81,34.96 36.8,35.97 36.8,38.51 35.31,40.01 v35.18,40.01 | R9.1 27.3,38.6 v27.43,38.73
  Bottom 0.152: v35.18,40.01 34.8,39.62 27.18,39.62 | 27.18,39.62 22.61,39.62 v22.35,39.37 | v27.43,38.73 27.43,39.37 27.18,39.62
SWCLK
  Top 0.152: U1.24 19.51,35.1 19.43,35.18 19.43,36.83 19.81,37.21 19.81,37.72 20.45,38.35 20.45,39.12 24.26,42.93 PROG.2
SWD
  Top 0.152: U1.25 20.68,35.5 21.3,36.12 22.66,36.12 22.99,36.45 22.99,38.99 26.8,42.8 PROG.3
USB_DM
  Top 0.152: R3.2 7.37,38.22 7.61,38.46 UPSTREAM_PORT.B7 7.62,40 7.62,40.89 7.49,41.02 6.73,41.02 6.61,40.9 UPSTREAM_PORT.A7
USB_DP
  Top 0.152: UPSTREAM_PORT.B6 6.11,38.1 | 6.11,38.1 6.11,37.95 R7.2 | UPSTREAM_PORT.A6 7.11,39.1 6.11,38.1
USER_LED
  Top 0.152: R20.2 42.42,24.38 39.75,27.05 39.75,36.83 36.45,40.13 36.45,43.43 37.34,44.32 38.73,44.32 38.99,44.58 38.99,46.23 38.73,46.48 20.95,46.48 20.45,45.97 20.45,42.93 19.81,42.29 16.64,42.29 16.09,41.74 16.09,38.65 16.26,38.48 16.89,38.48 17.3,38.07 U1.34
VCC  (via drill 0.25)
  Top 0.254: R5.1 C11.1 | C2.2 6.51,16.82
  Top 0.305: R4.1 32.88,37.47 v33.27,37.08 | R18.2 42.43,18.16 42.93,18.16 43.18,17.91 43.18,15.24 | v43.18,12.7 43.18,15.24 | 43.18,15.24 43.17,15.23 R19.2
  Top 0.356: 6.51,16.82 U6.1
  Top 0.508: UPSTREAM_PORT.A4B9 9.31,38.77 v9.27,38.73 | UPSTREAM_PORT.B4A9 4.41,38.77 v4.45,38.73 | C11.1 32.7,28.88 3V3_REG2.1 32.7,31.05 33.02,31.37 34.29,31.37 34.6,31.05 3V3_REG2.3 | v6.48,17.78 C2.2
  Top 0.762: 42.55,12.06 v41.91,12.7 | U$1.5V 42.55,12.06 | 42.55,12.06 v43.18,12.7 | v34.4,26.04 34.15,26.04 33.01,27.18 C11.1
  Bottom 0.508: v41.91,12.7 34.16,20.45 30.23,20.45 26.04,16.26 8,16.26 v6.48,17.78
  pour Route15: 33.78,-3.17 33.78,35.05 33.27,35.56 33.27,41.02 32.38,41.91 12.83,41.91 8.64,37.72 1.91,37.72 0.64,38.99 0.64,50.8 52.07,50.8 52.07,-3.17
VREG_OUT_1V1
  Top 0.203: C6.1 11.61,36.66 11.99,36.66 12.76,35.9 U1.45 14.01,35.9 | 14.01,35.9 14.1,35.81 14.1,34.04 13.96,33.9 U1.50 | 14.01,35.9 14.02,35.9 18.36,35.9 18.5,35.76 18.5,34.7 U1.23 20.87,34.7 21.72,35.55 C9.1
  Top 0.254: C7.1 C6.1
XIN
  Top 0.152: U1.20 24.67,33.5 25.29,32.88 X1.1 25.55,32.24 C1.1
XOUT
  Top 0.152: U1.21 22.6,33.9 23.41,34.71 X1.3 23.69,36.34 C5.1

### Text on the board
tPlace: 3V3 | CLK | SWD | ZXR | 5V | GND | RP BOOT | DATA | RP RUN | ZX RST | USER | /ROMCS | /ROMRQ
bPlace: ZXelerator / 2025 Smashcat